# Altium project PCB3-Lab3.PrjPcb
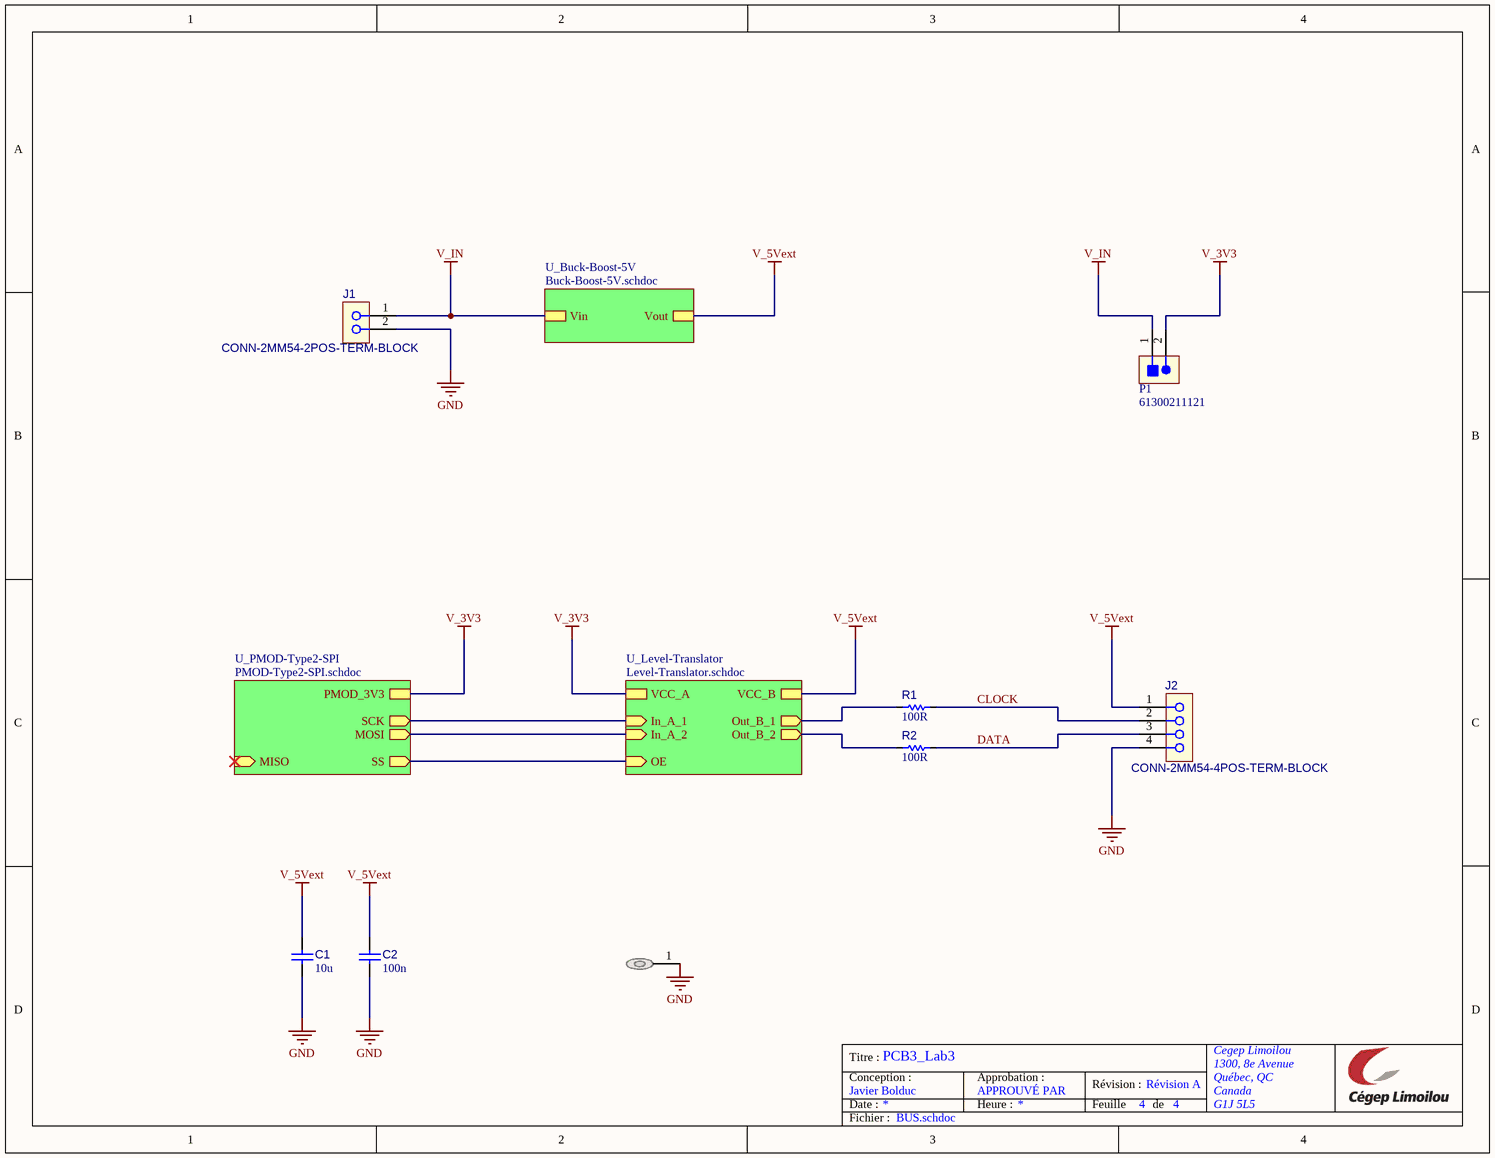
[diagram p0: BUS.schdoc]
NomDeLetudiant: Le nom de l'étudiant; NomDeProjet: Le nom de mon Projet; Revision: La Revision
4 sheets, 24 parts. Net scope: hierarchical (ports join the sheet entries above them; power ports are global).
Board file: Pcb1.PcbDoc
Sheets:
  BUS.schdoc
    U_Buck-Boost-5V = Buck-Boost-5V.schdoc
    U_Level-Translator = Level-Translator.schdoc
    U_PMOD-Type2-SPI = PMOD-Type2-SPI.schdoc

## Sheet BUS.schdoc: TITRE
size Letter; ApprovedBy: APPROUVÉ PAR; Author: Le nom de l'étudiant; Organization: Cegep Limoilou; Address1: 1300, 8e Avenue; Address2: Québec, QC; Address3: Canada; Address4: G1J 5L5; SheetNumber: 4; SheetTotal: 4

### Parts
C1  value 10u  [C_2012[0805]]  (hidden comment: CAP CER 10uF 10V X?? 0805)
C2  value 100n  [C_2012[0805]]  (hidden comment: CAP CER 100nF 50V 0805)
J1  CONN-2MM54-2POS-TERM-BLOCK  [CONN_TERM_BLOCK_2POS_100MIL]
J2  CONN-2MM54-4POS-TERM-BLOCK  [CONN_TERM_BLOCK_4POS_100MIL]
MH?  DNP  [MP_M-Hole_#4-40_LOOSE-FIT]  (value not drawn)  (no BOM)
P1  61300211121  [CONN_HDR_2POS_100MILS_TH]
R1  value 100R  [R_1608[0603]]  (hidden comment: Res 100R 1% 0603)
R2  value 100R  [R_1608[0603]]  (hidden comment: Res 100R 1% 0603)

### Sub-sheets
U_Buck-Boost-5V = Buck-Boost-5V.schdoc: Vout, Vin
U_Level-Translator = Level-Translator.schdoc: VCC_A, In_A_1 (in), In_A_2 (in), OE (in), Out_B_2 (out), Out_B_1 (out), VCC_B
U_PMOD-Type2-SPI = PMOD-Type2-SPI.schdoc: SS (out), MOSI (out), SCK (out), PMOD_3V3, MISO (in)

### Nets
GND: C1.2 C2.2 J1.2 J2.4 MH?.1
V_3V3: P1.2 ; sheet U_Level-Translator/VCC_A, sheet U_PMOD-Type2-SPI/PMOD_3V3
V_5Vext: C1.1 C2.1 J2.1 ; sheet U_Buck-Boost-5V/Vout, sheet U_Level-Translator/VCC_B
V_IN: J1.1 P1.1 ; sheet U_Buck-Boost-5V/Vin
CLOCK: J2.2 R1.2  [project net CLOCK_4]
DATA: J2.3 R2.2  [project net DATA_4]
In_A_1: sheet U_Level-Translator/In_A_1, sheet U_PMOD-Type2-SPI/SCK
In_A_2: sheet U_Level-Translator/In_A_2, sheet U_PMOD-Type2-SPI/MOSI
OE: sheet U_Level-Translator/OE, sheet U_PMOD-Type2-SPI/SS
Out_B_1: R1.1 ; sheet U_Level-Translator/Out_B_1
Out_B_2: R2.1 ; sheet U_Level-Translator/Out_B_2

### Notes on the sheet
- Titre :
- Conception :
- Date :
- Javier Bolduc
- PCB3_Lab3
- Approbation :
- Heure :
- Révision :
- Feuille
- Révision A
- de
- Fichier :

### Library data of the parts
C1 = CAP026: Capacitor type 1; LibRef: CAP026; Code CEGEP: KCOND94SM; Localisation: R13-C015-3; Rated Voltage: 10V; Mounting Technology: SMT
C2 = CAP008: Capacitor type 1; Manufacturer 1: Yageo; Manufacturer Part Number 1: CC0805KRX7R9BB104; LibRef: CAP008; Code CEGEP: KCOND0142SM; Tolerance: 10%; Dielectric: X7R; Rated Voltage: 50V; Mounting Technology: SMT; Supplier 1: LCSC; Supplier Part Number 1: C49678
J1 = CONN-2MM54-2POS-TERM-BLOCK: CONN TERM BLOCK 2POS 100mil pitch; Manufacturer 1: Dorabo; Manufacturer Part Number 1: DB125-2.54-2P-GN-S; Supplier 1: LCSC; Supplier Part Number 1: C918120; Mounting Technology: TH; Manufacturer 2: Amphenol; Manufacturer Part Number 2: VN02A1500000G; Supplier 2: Digikey; Supplier Part Number 2: VN02A1500000G-ND
J2 = CONN-2MM54-4POS-TERM-BLOCK: CONN TERM BLOCK 4POS 100mil pitch; Manufacturer 1: Dorabo; Manufacturer Part Number 1: DB125-2.54-4P-GN-S; Supplier 1: LCSC; Supplier Part Number 1: C918122; Mounting Technology: TH; Manufacturer 2: Amphenol; Manufacturer Part Number 2: VN04A1500000G; Supplier 2: Digikey; Supplier Part Number 2: VN04A1500000G-ND
MH? = MH-4-40: Mounting Hole #4-40 w/ Flat Washer; Manufacturer Part Number 1: DNP; Value: DNP; Supplier Part Number 1: N/A
P1 = CONN-100MIL-HDR-01X02: CONN HEADER 2POS 100MIL; Manufacturer 1: Megastar; Manufacturer Part Number 1: ZX-PZ2.54-1-2PZZ; Mounting Technology: TH; Supplier 1: LCSC; Supplier Part Number 1: C7501260; Manufacturer 2: Würth Elektronik; Manufacturer Part Number 2: 61300211121
R1 R2 = RES029: Resistor type 1; Manufacturer 1: Yageo; Manufacturer Part Number 1: RC0603FR-07100RL; LibRef: RES029; Puissance: 1/10W; Max Working Voltage: 75V; Tolerance: 1%; Mounting Technology: SMT; Supplier 1: LCSC; Supplier Part Number 1: C105588

## Sheet Buck-Boost-5V.schdoc: TITRE
size Letter; ApprovedBy: APPROUVÉ PAR; Author: Le nom de l'étudiant; Organization: Cegep Limoilou; Address1: 1300, 8e Avenue; Address2: Québec, QC; Address3: Canada; Address4: G1J 5L5; SheetNumber: 3; SheetTotal: 4
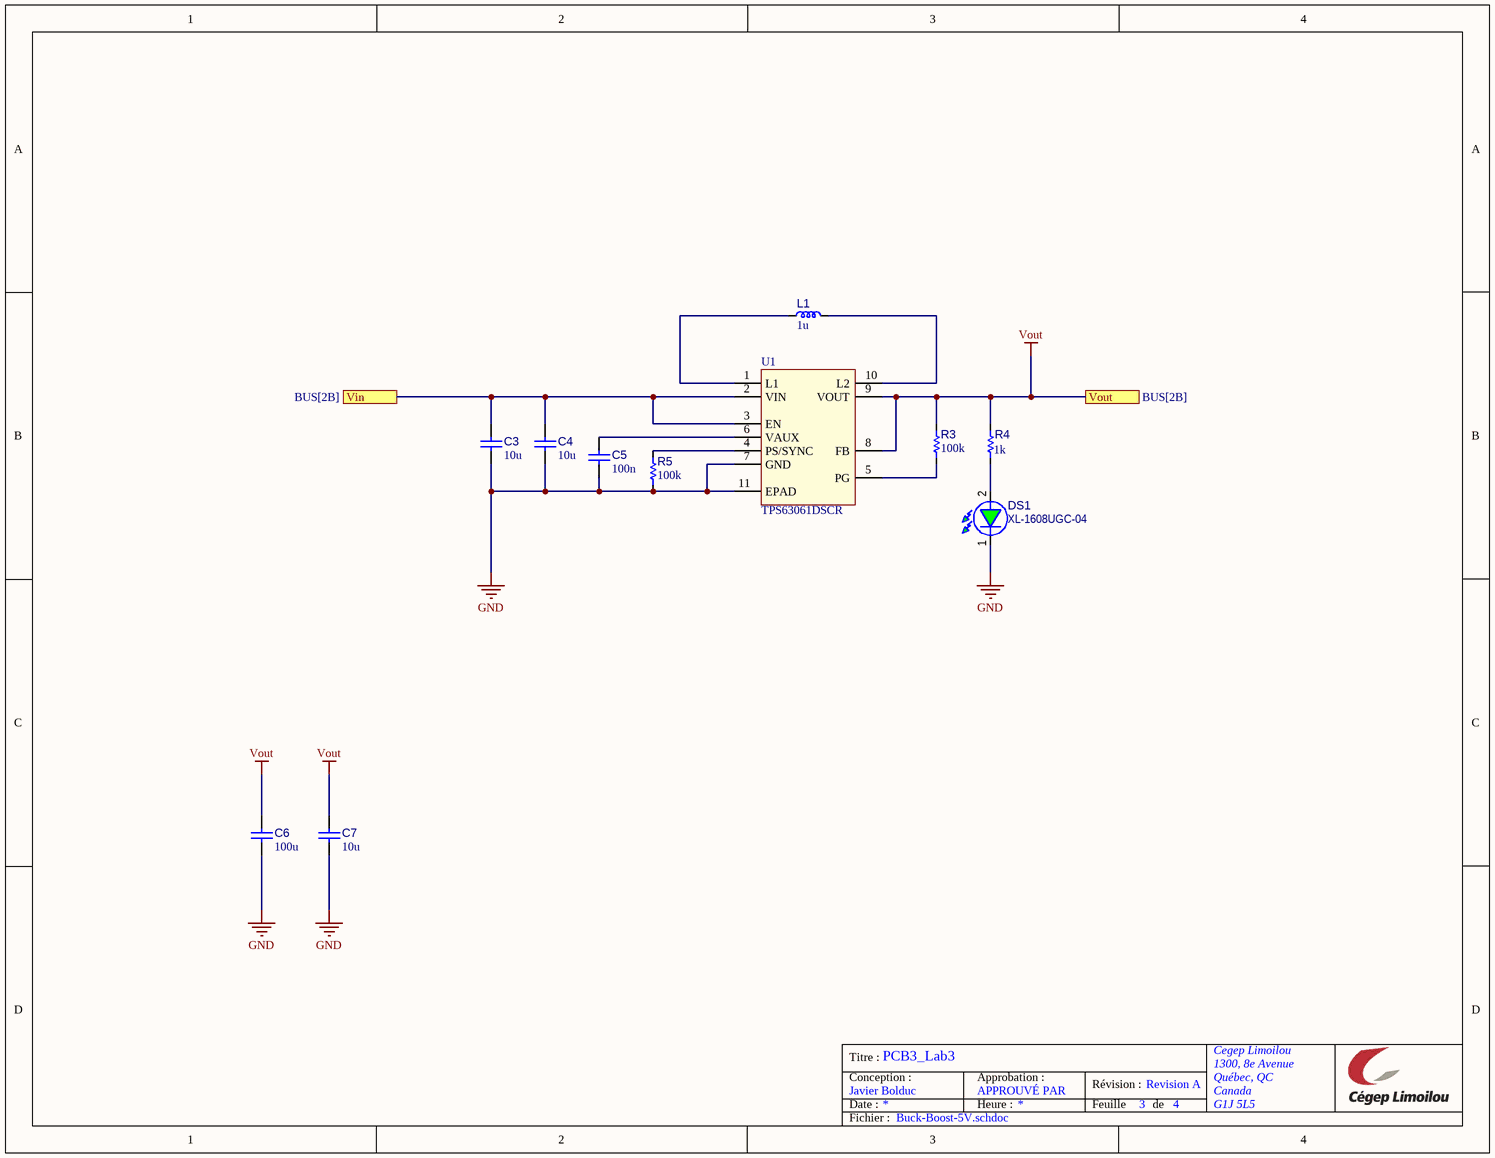
[diagram p1: Buck-Boost-5V.schdoc]

### Parts
C3  value 10u  [C_2012[0805]]  (hidden comment: CAP CER 10uF 10V X?? 0805)
C4  value 10u  [C_2012[0805]]  (hidden comment: CAP CER 10uF 10V X?? 0805)
C5  value 100n  [C_1608[0603]]  (hidden comment: CAP CER 100nF 50V 0603)
C6  value 100u  [C_3216[1206]]  (hidden comment: CAP CER 100uF 10V 1206)
C7  value 10u  [C_2012[0805]]  (hidden comment: CAP CER 10uF 10V X?? 0805)
DS1  XL-1608UGC-04  [D_LED_0603]
L1  value 1u  [L_3030[1212]]  (hidden comment: Inductor 1UH 1.6A 51mΩ SMD)
R3  value 100k  [R_1608[0603]]  (hidden comment: Res 100k 1% 0603)
R4  value 1k  [R_1608[0603]]  (hidden comment: Res 1k 1% 0603)
R5  value 100k  [R_1608[0603]]  (hidden comment: Res 100k 1% 0603)
U1  TPS63061DSCR  [U_WSON50P300X300X80-10N]

### Ports
Vin (see BUS[2B]), Vout (see BUS[2B])

### Nets
GND: C3.2 C4.2 C5.2 C6.2 C7.2 DS1.1(K) R5.2 U1.7(GND) U1.11(EPAD)
V_IN: C3.1 C4.1 U1.2(VIN) U1.3(EN) ; port Vin
Vout: C6.1 C7.1 R3.1 R4.1 U1.8(FB) U1.9(VOUT) ; port Vout  [project net V_5Vext]
NetC5_1: C5.1 U1.6(VAUX)
NetDS1_2: DS1.2(A) R4.2
NetL1_1: L1.1 U1.1(L1)
NetL1_2: L1.2 U1.10(L2)
NetR3_2: R3.2 U1.5(PG)
NetR5_1: R5.1 U1.4(PS/SYNC)

### Notes on the sheet
- Titre :
- Conception :
- Date :
- Javier Bolduc
- PCB3_Lab3
- Approbation :
- Heure :
- Révision :
- Feuille
- Revision A
- de
- Fichier :

### Library data of the parts
C3 C4 C7 = CAP026: as C1 on sheet BUS; Rated Voltage: 10V; Mounting Technology: SMT
C5 = CAP002: Capacitor type 1; Manufacturer 1: Yageo; Manufacturer Part Number 1: CC0603KRX7R9BB104; LibRef: CAP002; Code CEGEP: COND0143SM; Tolerance: 10%; Dielectric: X7R; Rated Voltage: 50V; Mounting Technology: SMT; Supplier 1: LCSC; Supplier Part Number 1: C14663
C6 = CAP005: Capacitor type 1; Manufacturer 1: Murata; Manufacturer Part Number 1: GRM31CR61A107MEA8L; LibRef: CAP005; Code CEGEP: KCOND04SM; Tolerance: 20%; Dielectric: X5R; Rated Voltage: 10V; Mounting Technology: SMT; Supplier 1: LCSC; Supplier Part Number 1: C883598
DS1 = D_LED_GREEN_0603: LED Green Clear 40mcd 140deg; Manufacturer 1: XINGLIGHT; Code CEGEP: KLEDVC0603; Value: Green; Manufacturer 2: Wurth; Manufacturer Part Number 1: XL-1608UGC-04; Manufacturer Part Number 2: 150060VS75000; Mounting Technology: SMT; Supplier 1: LCSC; Supplier 2: Digikey; Supplier Part Number 1: C965804; Supplier Part Number 2: 732-4980-1-ND
L1 = IND001: Inductor type 1; Manufacturer 1: Murata; Manufacturer Part Number 1: LQH3NPN1R0MMEL; LibRef: IND001; Code CEGEP: KPTSO09; Tolerance: 25%; Saturation Current: 2.35A; DCR: 0R025; Mounting Technology: SMT; Supplier 1: LCSC; Supplier Part Number 1: C703777
R3 R5 = RES002: Resistor type 1; Manufacturer 1: Yageo; Manufacturer Part Number 1: RC0603FR-07100KL; LibRef: RES002; Puissance: 1/10W; Max Working Voltage: 75V; Tolerance: 1%; Mounting Technology: SMT; Supplier 1: LCSC; Supplier Part Number 1: C14675
R4 = RES015: Resistor type 1; Manufacturer 1: Yageo; Manufacturer Part Number 1: RC0603FR-071KL; LibRef: RES015; Puissance: 1/10W; Max Working Voltage: 75V; Tolerance: 1%; Mounting Technology: SMT; Supplier 1: LCSC; Supplier Part Number 1: C22548
U1 = U_TPS63061DSC: IC REG BUCK BOOST 5V 2A 10WSON; Manufacturer 1: TI; Manufacturer Part Number 1: TPS63061DSCR; Mounting Technology: SMT; Supplier 1: LCSC; Supplier 2: Digikey; Supplier Part Number 1: C2876326; Supplier Part Number 2: 296-30205-1-ND

## Sheet Level-Translator.schdoc: TITRE
size Letter; ApprovedBy: APPROUVÉ PAR; Author: Le nom de l'étudiant; Organization: Cegep Limoilou; Address1: 1300, 8e Avenue; Address2: Québec, QC; Address3: Canada; Address4: G1J 5L5; SheetNumber: 4; SheetTotal: 4
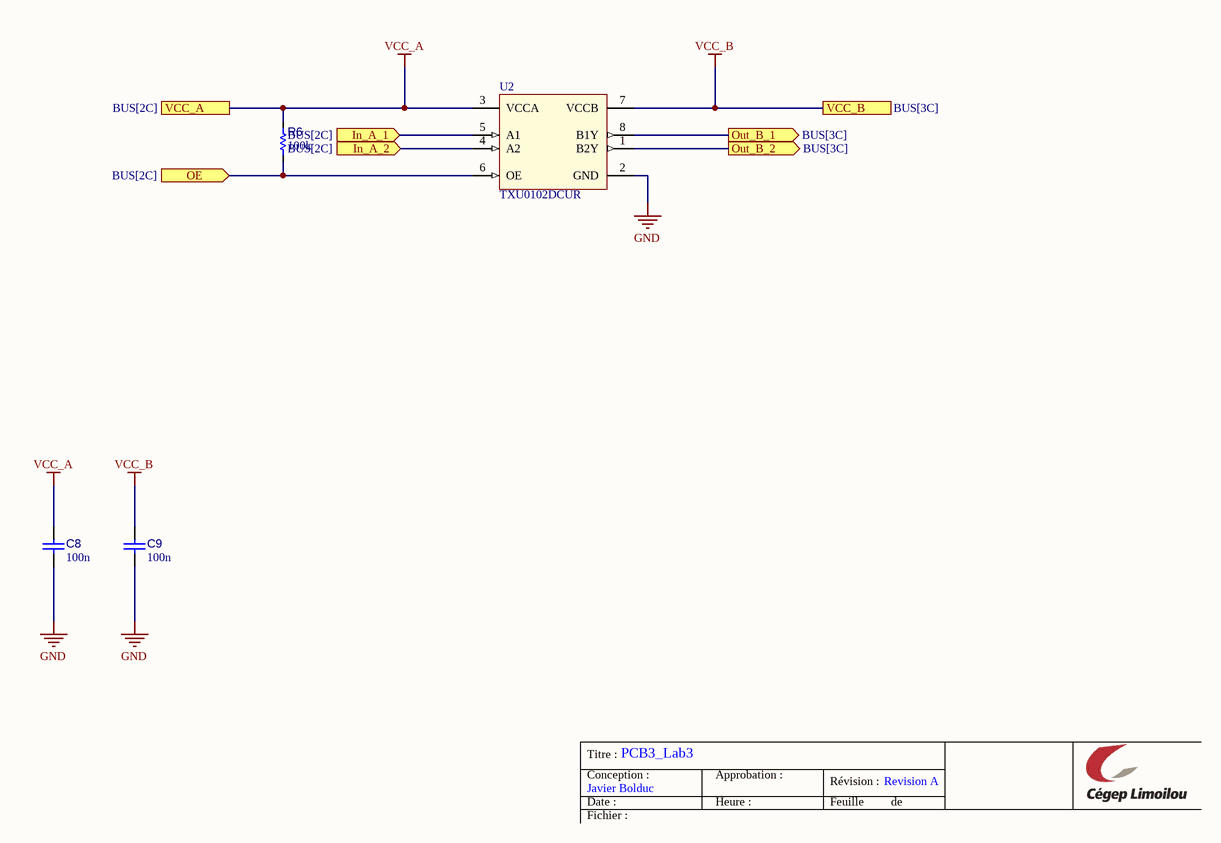
[diagram p2: Level-Translator.schdoc]

### Parts
C8  value 100n  [C_1608[0603]]  (hidden comment: CAP CER 100nF 50V 0603)
C9  value 100n  [C_1608[0603]]  (hidden comment: CAP CER 100nF 50V 0603)
R6  value 100k  [R_1608[0603]]  (hidden comment: Res 100k 1% 0603)
U2  TXU0102DCUR  [U_VSSOP50P310X200X90-8N]

### Ports
In_A_1 (in, see BUS[2C]), In_A_2 (in, see BUS[2C]), OE (in, see BUS[2C]), Out_B_1 (out, see BUS[3C]), Out_B_2 (out, see BUS[3C]), VCC_A (see BUS[2C]), VCC_B (see BUS[3C])

### Nets
GND: C8.2 C9.2 U2.2(GND)
VCC_A: C8.1 R6.1 U2.3(VCCA) ; port VCC_A  [project net V_3V3]
VCC_B: C9.1 U2.7(VCCB) ; port VCC_B  [project net V_5Vext]
In_A_1: U2.5(A1) ; port In_A_1
In_A_2: U2.4(A2) ; port In_A_2
OE: R6.2 U2.6(OE) ; port OE
Out_B_1: U2.8(B1Y) ; port Out_B_1
Out_B_2: U2.1(B2Y) ; port Out_B_2

### Notes on the sheet
- Titre :
- Conception :
- Date :
- Javier Bolduc
- PCB3_Lab3
- Approbation :
- Heure :
- Révision :
- Feuille
- Revision A
- de
- Fichier :

### Library data of the parts
C8 C9 = CAP002: as C5 on sheet Buck-Boost-5V; Rated Voltage: 50V; Mounting Technology: SMT; Supplier 1: LCSC; Supplier Part Number 1: C14663
R6 = RES002: as R3 on sheet Buck-Boost-5V; Tolerance: 1%; Mounting Technology: SMT; Supplier 1: LCSC; Supplier Part Number 1: C14675
U2 = U_TXU0102DCU: Two channel fixed-direction level shifter 8-VSSOP; Manufacturer 1: TI; Manufacturer Part Number 1: TXU0102DCUR; Mounting Technology: SMT; Supplier 1: LCSC; Supplier 2: Digikey; Supplier Part Number 1: C5217871; Supplier Part Number 2: 296-TXU0102DCURCT-ND

## Sheet PMOD-Type2-SPI.schdoc: TITRE
size Letter; ApprovedBy: APPROUVÉ PAR; Author: Le nom de l'étudiant; Organization: Cegep Limoilou; Address1: 1300, 8e Avenue; Address2: Québec, QC; Address3: Canada; Address4: G1J 5L5; SheetNumber: 2; SheetTotal: 4
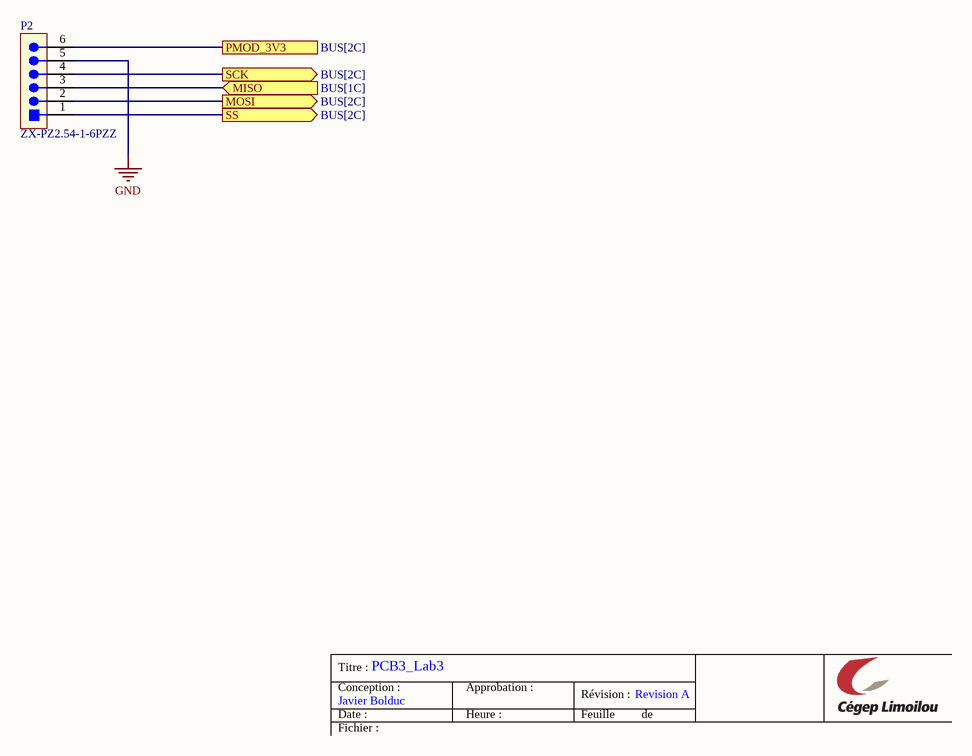
[diagram p3: PMOD-Type2-SPI.schdoc]

### Parts
P2  ZX-PZ2.54-1-6PZZ  [CONN_HDR_01X06_100MIL]  (no BOM)

### Ports
MISO (in, see BUS[1C]), MOSI (out, see BUS[2C]), PMOD_3V3 (see BUS[2C]), SCK (out, see BUS[2C]), SS (out, see BUS[2C])

### Nets
GND: P2.5
V_3V3: P2.6 ; port PMOD_3V3
In_A_1: P2.4 ; port SCK
In_A_2: P2.2 ; port MOSI
MISO: P2.3 ; port MISO
OE: P2.1 ; port SS

### Notes on the sheet
- Titre :
- Conception :
- Date :
- Javier Bolduc
- PCB3_Lab3
- Approbation :
- Heure :
- Révision :
- Feuille
- Revision A
- de
- Fichier :

### Library data of the parts
P2 = CONN-100MIL-HDR-01X06: Conn. Header 6pos 100mils; Manufacturer 1: Megastar; Mounting Technology: TH; Manufacturer Part Number 1: ZX-PZ2.54-1-6PZZ; Manufacturer 2: Würth Elektronik; Manufacturer Part Number 2: 61300611121; Supplier 1: LCSC; Supplier 2: Digikey; Supplier Part Number 2: 732-5319-ND; Supplier Part Number 1: C7501264

## Nets that join several sheets
GND: BUS (5 pins), Buck-Boost-5V (9 pins), Level-Translator (C8.2 C9.2 U2.2), PMOD-Type2-SPI (P2.5)
V_3V3: BUS (P1.2), Level-Translator (C8.1 R6.1 U2.3), PMOD-Type2-SPI (P2.6)
V_5Vext: BUS (C1.1 C2.1 J2.1), Buck-Boost-5V (6 pins), Level-Translator (C9.1 U2.7)
V_IN: BUS (J1.1 P1.1), Buck-Boost-5V (C3.1 C4.1 U1.2 U1.3)
In_A_1: Level-Translator (U2.5), PMOD-Type2-SPI (P2.4)
In_A_2: Level-Translator (U2.4), PMOD-Type2-SPI (P2.2)
OE: Level-Translator (R6.2 U2.6), PMOD-Type2-SPI (P2.1)
Out_B_1: BUS (R1.1), Level-Translator (U2.8)
Out_B_2: BUS (R2.1), Level-Translator (U2.1)